# Altium project PCB_PROJECT.PrjPcb
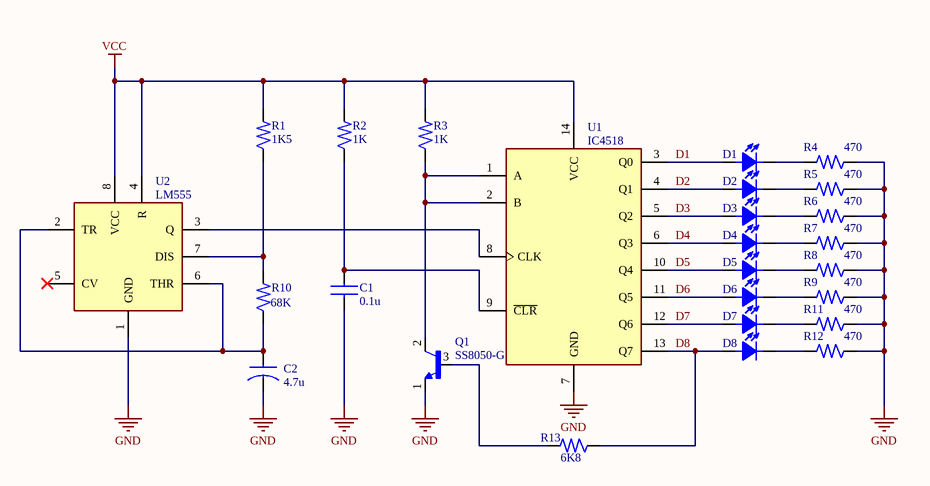
[diagram p0: Sheet1.SchDoc]
1 sheet, 26 parts. Net scope: global (net labels, ports and power ports of the same name join across sheets).
Board files: PCB1.PcbDoc, PCB2.PcbDoc

## Sheet Sheet1.SchDoc
size 292 x 193 mm; SheetNumber: 1; SheetTotal: 1

### Parts
C1  0.1u  [CAP_8x11mm]
C2  4.7u  [CAP_8x11mm]
D1  LED  [LED-TH-2.54mm-RED]  (value not drawn)
D2  LED  [LED-TH-2.54mm-RED]  (value not drawn)
D3  LED  [LED-TH-2.54mm-RED]  (value not drawn)
D4  LED  [LED-TH-2.54mm-RED]  (value not drawn)
D5  LED  [LED-TH-2.54mm-RED]  (value not drawn)
D6  LED  [LED-TH-2.54mm-RED]  (value not drawn)
D7  LED  [LED-TH-2.54mm-RED]  (value not drawn)
D8  LED  [LED-TH-2.54mm-RED]  (value not drawn)
Q1  SS8050-G  [TO-92]
R1  1K5  [RES0805_SMD]
R2  1K  [RES0805_SMD]
R3  1K  [RES0805_SMD]
R4  470  [RES0805_SMD]
R5  470  [RES0805_SMD]
R6  470  [RES0805_SMD]
R7  470  [RES0805_SMD]
R8  470  [RES0805_SMD]
R9  470  [RES0805_SMD]
R10  68K  [RES0805_SMD]
R11  470  [RES0805_SMD]
R12  470  [RES0805_SMD]
R13  6K8  [RES0805_SMD]
U1  IC4518  [DIP794W45P254L1969H508Q14]
U2  LM555  [LM555]

### Nets
GND: C1.2 C2.2 Q1.1(B) R4.1 R5.1 R6.1 R7.1 R8.1 R9.1 R11.1 R12.1 U1.7(GND) U2.1(GND)
VCC: R1.2 R2.2 R3.2 U1.14(VCC) U2.4(R) U2.8(VCC)
D1: D1.1(A) U1.3(Q0)
D2: D2.1(A) U1.4(Q1)
D3: D3.1(A) U1.5(Q2)
D4: D4.1(A) U1.6(Q3)
D5: D5.1(A) U1.10(Q4)
D6: D6.1(A) U1.11(Q5)
D7: D7.1(A) U1.12(Q6)
D8: D8.1(A) R13.1 U1.13(Q7)
NetC1_1: C1.1 R2.1 U1.9(~{CLR})
NetC2_1: C2.1 R10.1 U2.2(TR) U2.6(THR)
NetD1_2: D1.2(K) R4.2
NetD2_2: D2.2(K) R5.2
NetD3_2: D3.2(K) R6.2
NetD4_2: D4.2(K) R7.2
NetD5_2: D5.2(K) R8.2
NetD6_2: D6.2(K) R9.2
NetD7_2: D7.2(K) R11.2
NetD8_2: D8.2(K) R12.2
NetQ1_2: Q1.2(E) R3.1 U1.1(A) U1.2(B)
NetQ1_3: Q1.3(C) R13.2
NetR1_1: R1.1 R10.2 U2.7(DIS)
NetU1_8: U1.8(CLK) U2.3(Q)

Not connected (* = marked no-connect by the designer): U2 5(CV)*

### Library data of the parts
C1 = CAPACITOR: Design Item ID: *; Package: *; Size: *; Value: 0.1u; MF: *; MP: *; Supplier: *
C2 = CAPACITOR_1: Design Item ID: *; Package: *; Size: *; Value: 4.7u; MF: *; MP: *; Supplier: *
Q1 = SS8050-G: Bipolar (BJT) Transistor NPN 25 V 1.5 A 100MHz 300 mW Surface Mount SOT-23-3; MP: SS8050G; MF: Comchip; Digi-Key_Part_Number: 641-1790-2-ND; Check_prices: https://www.snapeda.com/parts/SS8050G/Comchip/view-part/?ref=eda; Package: None; SnapEDA_Link: https://www.snapeda.com/parts/SS8050G/Comchip/view-part/?ref=snap; Value: *
R1-R13 = RESISTOR: Design Item ID: *; Package: *; Size: *; MF: *; MP: *; Supplier: *
  R1: Value: 1K5
  R2 R3: Value: 1K
  R4-R9 R11 R12: Value: 470
  R10: Value: 68K
  R13: Value: 6K8
U1 = IC4518: CMOS Dual BCD Up-Counter; MF: Texas Instruments; MP: CD4518BE; SnapEDA_Link: https://www.snapeda.com/parts/CD4518BE/Texas+Instruments/view-part/?ref=snap; Package: PDIP-16 Texas Instruments; Value: *; Check_prices: https://www.snapeda.com/parts/CD4518BE/Texas+Instruments/view-part/?ref=eda
U2 = LM555CN/NOPB: Highly Stable 555 Timer; MF: Texas Instruments; SnapEDA_Link: https://www.snapeda.com/parts/LM555CN/NOPB/Texas+Instruments/view-part/?ref=snap; Package: PDIP-8 Texas; Value: *; MP: LM555CN/NOPB; Check_prices: https://www.snapeda.com/parts/LM555CN/NOPB/Texas+Instruments/view-part/?ref=eda
D1-D8 = LED: Value: *; Size: *; MF: *; MP: *